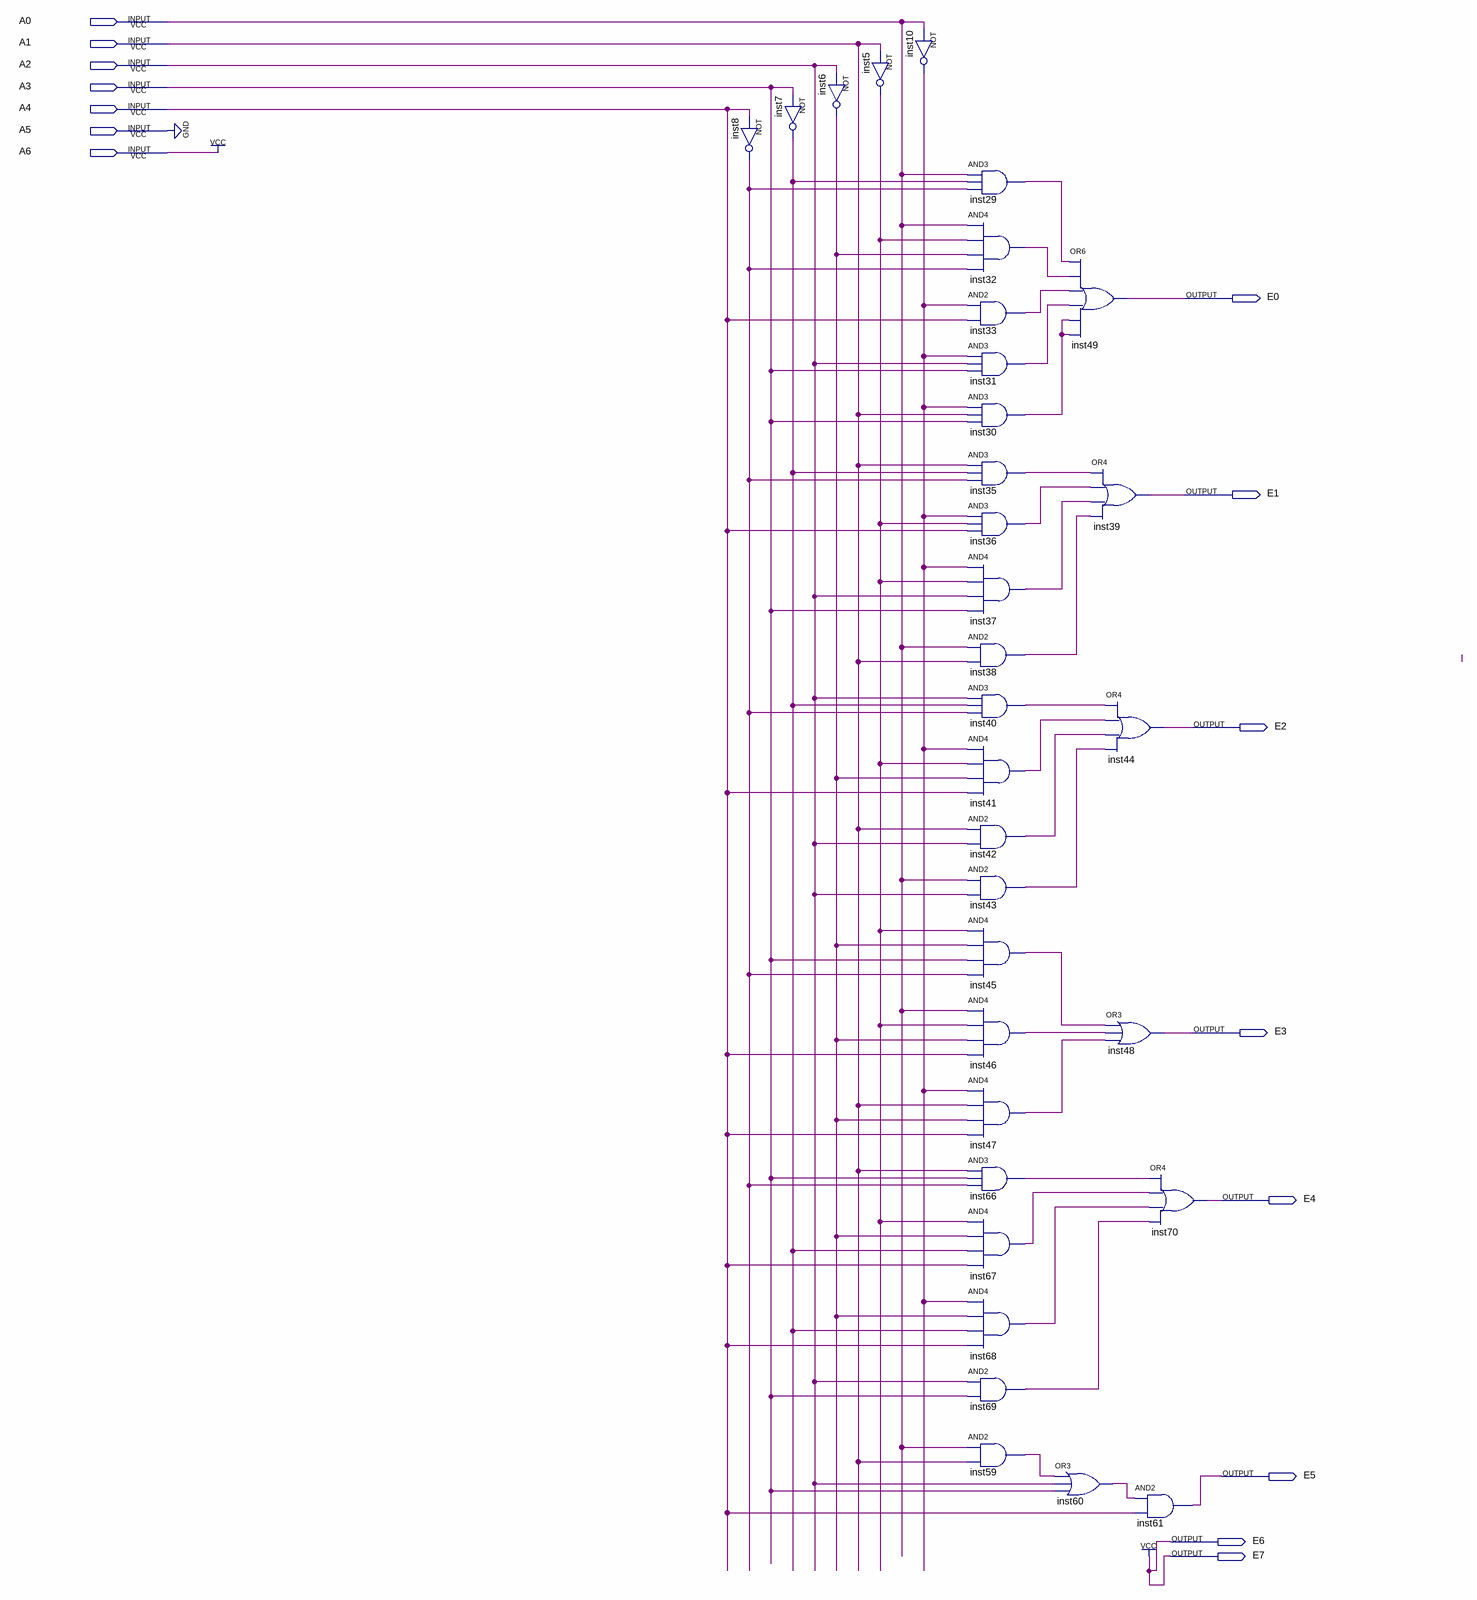
[diagram p0: schematic sheet]
// Quartus schematic DEProj1.bdf as structural Verilog: 33 symbols, 15 pins
module DEProj1 (
  input  A0,
  input  A1,
  input  A2,
  input  A3,
  input  A4,
  input  A5,
  input  A6,
  output E0,
  output E1,
  output E2,
  output E3,
  output E4,
  output E5,
  output E6,
  output E7
);

  wire inst5_out, inst6_out, inst7_out, inst8_out, inst10_out, inst29_out, inst30_out, inst31_out,
       inst32_out, inst33_out, inst35_out, inst36_out, inst37_out, inst38_out, inst40_out, inst41_out,
       inst42_out, inst43_out, inst45_out, inst46_out, inst47_out, inst59_out, inst60_out, inst66_out,
       inst67_out, inst68_out, inst69_out;

  not inst8 (inst8_out, A4);
  not inst7 (inst7_out, A3);
  not inst5 (inst5_out, A1);
  not inst6 (inst6_out, A2);
  not inst10 (inst10_out, A0);
  and inst29 (inst29_out, A0, inst7_out, inst8_out);
  and inst32 (inst32_out, A0, inst5_out, inst6_out, inst8_out);
  and inst33 (inst33_out, inst10_out, A4);
  and inst31 (inst31_out, inst10_out, A2, A3);
  and inst30 (inst30_out, inst10_out, A1, A3);
  and inst35 (inst35_out, A1, inst7_out, inst8_out);
  and inst36 (inst36_out, inst10_out, inst5_out, A4);
  and inst37 (inst37_out, inst10_out, inst5_out, A2, A3);
  and inst38 (inst38_out, A0, A1);
  and inst40 (inst40_out, A2, inst7_out, inst8_out);
  and inst41 (inst41_out, inst10_out, inst5_out, inst6_out, A4);
  and inst42 (inst42_out, A1, A2);
  and inst43 (inst43_out, A0, A2);
  and inst45 (inst45_out, inst5_out, inst6_out, A3, inst8_out);
  and inst46 (inst46_out, A0, inst5_out, inst6_out, A4);
  and inst47 (inst47_out, inst10_out, A1, inst6_out, A4);
  and inst66 (inst66_out, A1, A3, inst8_out);
  and inst67 (inst67_out, inst5_out, inst6_out, inst7_out, A4);
  and inst68 (inst68_out, inst10_out, inst6_out, inst7_out, A4);
  and inst69 (inst69_out, A2, A3);
  and inst59 (inst59_out, A0, A1);
  or inst49 (E0, inst29_out, inst32_out, inst33_out, inst31_out, inst30_out, inst30_out);
  or inst39 (E1, inst35_out, inst36_out, inst37_out, inst38_out);
  or inst60 (inst60_out, inst59_out, A2, A3);
  or inst44 (E2, inst40_out, inst41_out, inst42_out, inst43_out);
  or inst48 (E3, inst45_out, inst46_out, inst47_out);
  or inst70 (E4, inst66_out, inst67_out, inst68_out, inst69_out);
  and inst61 (E5, inst60_out, A4);

  assign E6 = 1'b1;
  assign E7 = 1'b1;
  // also tied to GND on the sheet: A5
  // also tied to VCC on the sheet: A6
endmodule
